# Altium project DecodeBufferLatch.PrjPcb
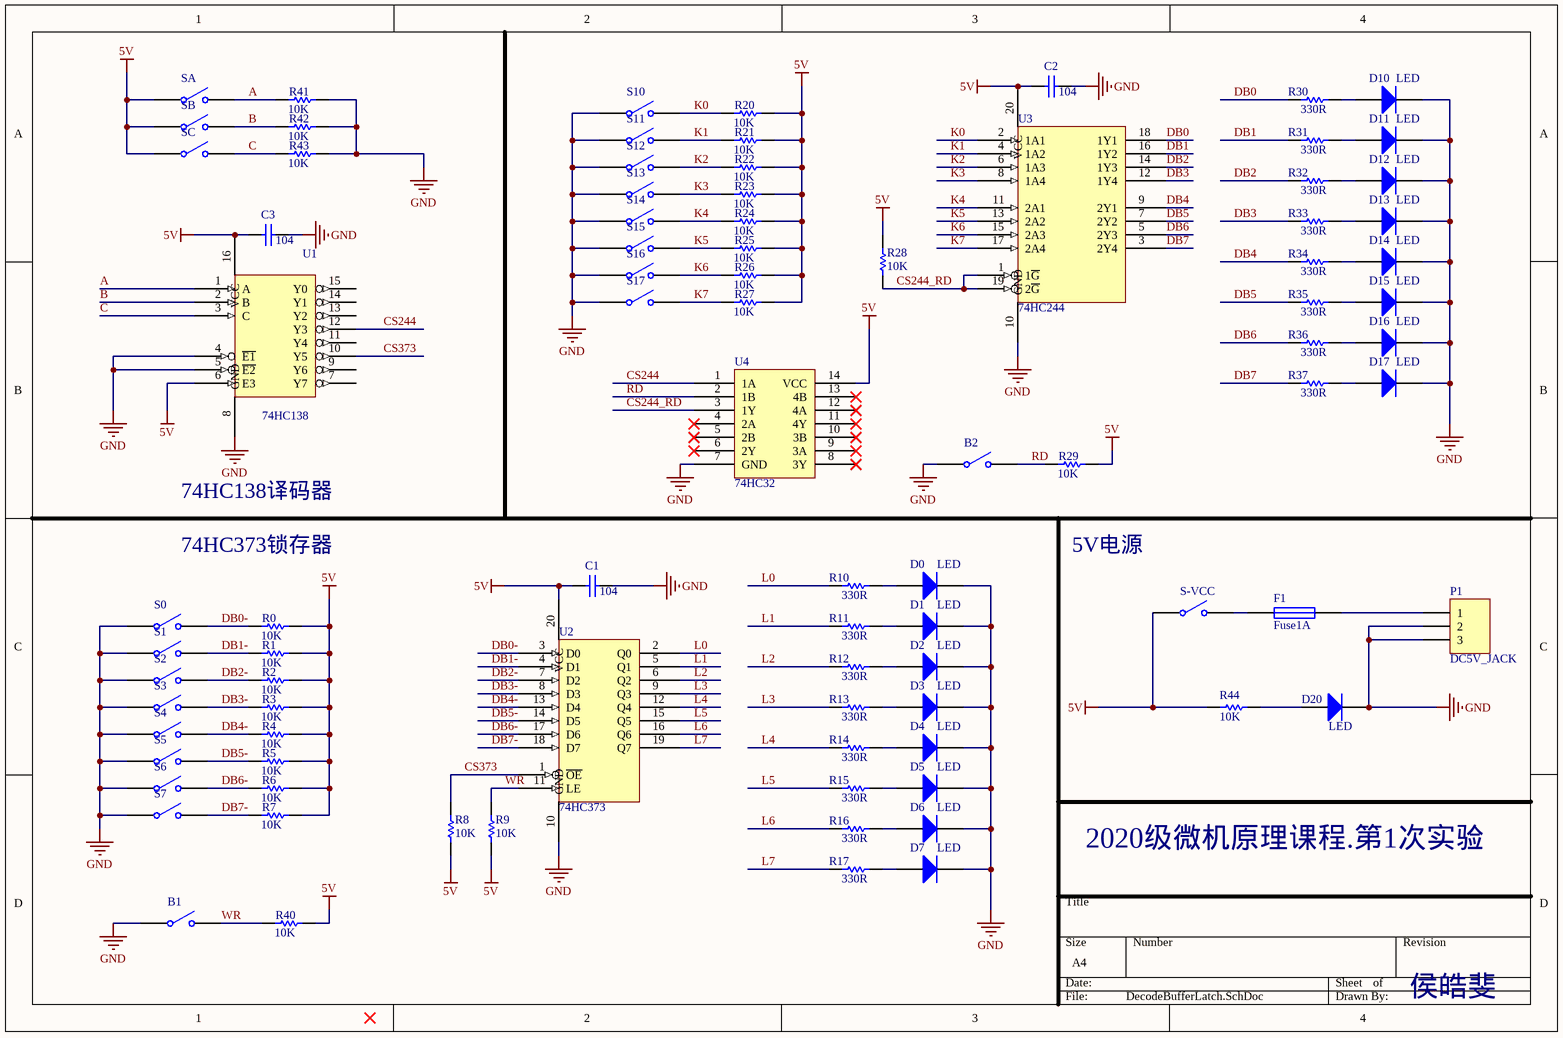
[diagram p0: DecodeBufferLatch.SchDoc]
1 sheet, 89 parts. Net scope: global (net labels, ports and power ports of the same name join across sheets).
Board file: DecodeBufferLatch.PcbDoc

## Sheet DecodeBufferLatch.SchDoc
size A4; PageSetup: Record=PageOptions?CenterHorizontal=True?CenterVertical=True?PrintScale=1.00?XCorrection=1.00?YCorrection=1.00?PrintKind=0?BorderSize=5000000?LeftOffset=0?BottomOffset=0?Orientation=2?PaperLength=1000?PaperWidth=1000?Scale=100?PaperSource=7?PrintQuality=-4?MediaType=1?DitherType=10?PaperKind=A4?PrintScaleMode=1

### Parts
B1  SW-SPST  [KEY_RESET]  (value not drawn)
B2  SW-SPST  [KEY_RESET]  (value not drawn)
C1  104  [0805C]
C2  104  [0805C]
C3  104  [0805C]
D0  LED  [LED1]
D1  LED  [LED1]
D2  LED  [LED1]
D3  LED  [LED1]
D4  LED  [LED1]
D5  LED  [LED1]
D6  LED  [LED1]
D7  LED  [LED1]
D10  LED  [LED1]
D11  LED  [LED1]
D12  LED  [LED1]
D13  LED  [LED1]
D14  LED  [LED1]
D15  LED  [LED1]
D16  LED  [LED1]
D17  LED  [LED1]
D20  LED  [LED1]
F1  Fuse1A  [1206]
P1  DC5V_JACK  [DCJACK]
R0  10K  [0805]
R1  10K  [0805]
R2  10K  [0805]
R3  10K  [0805]
R4  10K  [0805]
R5  10K  [0805]
R6  10K  [0805]
R7  10K  [0805]
R8  10K  [0805]
R9  10K  [0805]
R10  330R  [0805]
R11  330R  [0805]
R12  330R  [0805]
R13  330R  [0805]
R14  330R  [0805]
R15  330R  [0805]
R16  330R  [0805]
R17  330R  [0805]
R20  10K  [0805]
R21  10K  [0805]
R22  10K  [0805]
R23  10K  [0805]
R24  10K  [0805]
R25  10K  [0805]
R26  10K  [0805]
R27  10K  [0805]
R28  10K  [0805]
R29  10K  [0805]
R30  330R  [0805]
R31  330R  [0805]
R32  330R  [0805]
R33  330R  [0805]
R34  330R  [0805]
R35  330R  [0805]
R36  330R  [0805]
R37  330R  [0805]
R40  10K  [0805]
R41  10K  [0805]
R42  10K  [0805]
R43  10K  [0805]
R44  10K  [0805]
S0  SW-SPST  [BM]  (value not drawn)
S1  SW-SPST  [BM]  (value not drawn)
S2  SW-SPST  [BM]  (value not drawn)
S3  SW-SPST  [BM]  (value not drawn)
S4  SW-SPST  [BM]  (value not drawn)
S5  SW-SPST  [BM]  (value not drawn)
S6  SW-SPST  [BM]  (value not drawn)
S7  SW-SPST  [BM]  (value not drawn)
S10  SW-SPST  [BM]  (value not drawn)
S11  SW-SPST  [BM]  (value not drawn)
S12  SW-SPST  [BM]  (value not drawn)
S13  SW-SPST  [BM]  (value not drawn)
S14  SW-SPST  [BM]  (value not drawn)
S15  SW-SPST  [BM]  (value not drawn)
S16  SW-SPST  [BM]  (value not drawn)
S17  SW-SPST  [BM]  (value not drawn)
S-VCC  SW-SPST  [BM]  (value not drawn)
SA  SW-SPST  [BM]  (value not drawn)
SB  SW-SPST  [BM]  (value not drawn)
SC  SW-SPST  [BM]  (value not drawn)
U1  74HC138  [DIP-16]
U2  74HC373  [DIP20]
U3  74HC244  [DIP20]
U4  74HC32  [DIP14]

### Nets
5V: C1.2 C2.2 C3.2 R0.2 R1.2 R2.2 R3.2 R4.2 R5.2 R6.2 R7.2 R8.2 R9.2 R20.2 R21.2 R22.2 R23.2 R24.2 R25.2 R26.2 R27.2 R28.2 R29.2 R40.2 R44.1 S-VCC.1(COMMON) SA.1(COMMON) SB.1(COMMON) SC.1(COMMON) U1.6(E3) U1.16(VCC) U2.20(VCC) U3.20(VCC) U4.14(VCC)  [also labelled VCC]
GND: B1.1(COMMON) B2.1(COMMON) C1.1 C2.1 C3.1 D0.2(K) D1.2(K) D2.2(K) D3.2(K) D4.2(K) D5.2(K) D6.2(K) D7.2(K) D10.2(K) D11.2(K) D12.2(K) D13.2(K) D14.2(K) D15.2(K) D16.2(K) D17.2(K) D20.2(K) P1.2 P1.3 R41.2 R42.2 R43.2 S0.1(COMMON) S1.1(COMMON) S2.1(COMMON) S3.1(COMMON) S4.1(COMMON) S5.1(COMMON) S6.1(COMMON) S7.1(COMMON) S10.1(COMMON) S11.1(COMMON) S12.1(COMMON) S13.1(COMMON) S14.1(COMMON) S15.1(COMMON) S16.1(COMMON) S17.1(COMMON) U1.4(~{E1}) U1.5(~{E2}) U1.8(GND) U2.10(GND) U3.10(GND) U4.7(GND)
A: R41.1 SA.2(NO) U1.1(A)
B: R42.1 SB.2(NO) U1.2(B)
C: R43.1 SC.2(NO) U1.3(C)
CS244: U1.12(Y3) U4.1(1A)
CS244_RD: R28.1 U3.1(1~{G}) U3.19(2~{G}) U4.3(1Y)
CS373: R8.1 U1.10(Y5) U2.1(~{OE})
DB0: R30.1 U3.18(1Y1)
DB0-: R0.1 S0.2(NO) U2.3(D0)
DB1: R31.1 U3.16(1Y2)
DB1-: R1.1 S1.2(NO) U2.4(D1)
DB2: R32.1 U3.14(1Y3)
DB2-: R2.1 S2.2(NO) U2.7(D2)
DB3: R33.1 U3.12(1Y4)
DB3-: R3.1 S3.2(NO) U2.8(D3)
DB4: R34.1 U3.9(2Y1)
DB4-: R4.1 S4.2(NO) U2.13(D4)
DB5: R35.1 U3.7(2Y2)
DB5-: R5.1 S5.2(NO) U2.14(D5)
DB6: R36.1 U3.5(2Y3)
DB6-: R6.1 S6.2(NO) U2.17(D6)
DB7: R37.1 U3.3(2Y4)
DB7-: R7.1 S7.2(NO) U2.18(D7)
K0: R20.1 S10.2(NO) U3.2(1A1)
K1: R21.1 S11.2(NO) U3.4(1A2)
K2: R22.1 S12.2(NO) U3.6(1A3)
K3: R23.1 S13.2(NO) U3.8(1A4)
K4: R24.1 S14.2(NO) U3.11(2A1)
K5: R25.1 S15.2(NO) U3.13(2A2)
K6: R26.1 S16.2(NO) U3.15(2A3)
K7: R27.1 S17.2(NO) U3.17(2A4)
L0: R10.1 U2.2(Q0)
L1: R11.1 U2.5(Q1)
L2: R12.1 U2.6(Q2)
L3: R13.1 U2.9(Q3)
L4: R14.1 U2.12(Q4)
L5: R15.1 U2.15(Q5)
L6: R16.1 U2.16(Q6)
L7: R17.1 U2.19(Q7)
RD: B2.2(NO) R29.1 U4.2(1B)
WR: B1.2(NO) R9.1 R40.1 U2.11(LE)
NetD0_1: D0.1(A) R10.2
NetD1_1: D1.1(A) R11.2
NetD2_1: D2.1(A) R12.2
NetD3_1: D3.1(A) R13.2
NetD4_1: D4.1(A) R14.2
NetD5_1: D5.1(A) R15.2
NetD6_1: D6.1(A) R16.2
NetD7_1: D7.1(A) R17.2
NetD10_1: D10.1(A) R30.2
NetD11_1: D11.1(A) R31.2
NetD12_1: D12.1(A) R32.2
NetD13_1: D13.1(A) R33.2
NetD14_1: D14.1(A) R34.2
NetD15_1: D15.1(A) R35.2
NetD16_1: D16.1(A) R36.2
NetD17_1: D17.1(A) R37.2
NetD20_1: D20.1(A) R44.2
NetF1_1: F1.1 S-VCC.2(NO)
NetF1_2: F1.2 P1.1

Not connected (* = marked no-connect by the designer): U1 7(Y7) 9(Y6) 11(Y4) 13(Y2) 14(Y1) 15(Y0); U4 4(2A)* 5(2B)* 6(2Y)* 8(3Y)* 9(3A)* 10(3B)* 11(4Y)* 12(4A)* 13(4B)*

### Notes on the sheet
- 74HC138译码器
- 74HC373锁存器
- 5V电源
- 2020级微机原理课程.第1次实验
- 侯皓斐

### Library data of the parts
B1 B2 S0-S7 S10-S17 S-VCC SA SB SC = SW-SPST: Single-Pole, Single-Throw Switch; Published: 24-Mar-1999; LatestRevisionDate: 17-Jul-2002; LatestRevisionNote: Re-released for DXP Platform.; PackageReference: SPST-2; Publisher: Altium Limited; PackageDescription: Switch; 2 Leads
C1-C3 = Cap: Capacitor; Published: 8-Jun-2000; LatestRevisionDate: 17-Jul-2002; LatestRevisionNote: Re-released for DXP Platform.; PackageReference: RAD-0.3; Publisher: Altium Limited; Value: 104
D0-D7 D10-D17 D20 = Diode 1N4148: High Conductance Fast Diode; Published: 8-Jun-2000; LatestRevisionDate: 17-Jul-2002; LatestRevisionNote: Re-released for DXP Platform.; DatasheetVersion: 1997; PackageReference: DO-35; Publisher: Altium Limited; PackageDescription: Diode, Axial; Body 3.8 x 1.9 mm (LxDia. max), Lead Dia. 0.53 mm (max); Code_JEDEC: DO-204-AH; ComponentLink1Description: Manufacturer Link; ComponentLink1URL: http://www.fairchildsemi.com/; ComponentLink2Description: Datasheet; ComponentLink2URL: http://www.fairchildsemi.com/ds/1N%2F1N4148.pdf
F1 = Fuse 1: Fuse; Published: 8-Jun-2000; LatestRevisionDate: 17-Jul-2002; LatestRevisionNote: Re-released for DXP Platform.; PackageReference: PIN-W2/E2.8; Publisher: Altium Limited; PackageDescription: Thru-Hole; 2 Leads
P1 = Header 3: Header, 3-Pin; LatestRevisionDate: 17-Jul-2002; LatestRevisionNote: Re-released for DXP Platform.; Publisher: Altium Limited
R0-R17 R20-R37 R40-R43 = Res1: Resistor; Published: 8-Jun-2000; LatestRevisionDate: 17-Jul-2002; LatestRevisionNote: Re-released for DXP Platform.; PackageReference: AXIAL-0.3; Publisher: Altium Limited; PackageDescription: Axial Device, Thru-Hole; 2 Leads; 0.3 in Pin Spacing
  R0 R1 R8 R9 R20 R21 R28 R29 R40-R42: Value: 10K
  R2-R7 R22-R27 R43: Value: 10k
  R10-R17 R30-R37: Value: 330R
R44 = Res1: Resistor; Value: 330R; Published: 8-Jun-2000; LatestRevisionDate: 17-Jul-2002; LatestRevisionNote: Re-released for DXP Platform.; PackageReference: AXIAL-0.3; Publisher: Altium Limited; PackageDescription: Axial Device, Thru-Hole; 2 Leads; 0.3 in Pin Spacing
U1 = 74ALS138
U2 = 74LS373
U3 = 74LS244
U4 = 74HC32: TI